# EAGLE design BeatleCPU2 (EAGLE 9.2.0)
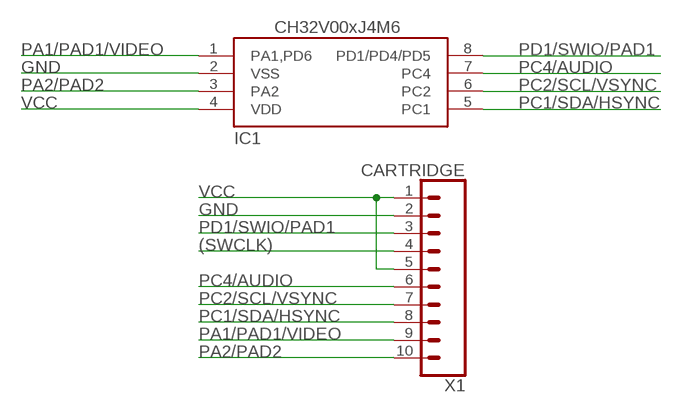
[diagram p0: schematic, sheet 1]

## Parts
IC1  CH32V00xJ4M6  CH32V003J4M6  [SOP8]
X1  CARTRIDGE  CONN_10  [1X10_LONGPADS]

## Nets
(SWCLK): X1.4
GND: IC1.2(VSS) X1.2
PA1/PAD1/VIDEO: IC1.1(PA1,PD6) X1.9
PA2/PAD2: IC1.3(PA2) X1.10
PC1/SDA/HSYNC: IC1.5(PC1) X1.8
PC2/SCL/VSYNC: IC1.6(PC2) X1.7
PC4/AUDIO: IC1.7(PC4) X1.6
PD1/SWIO/PAD1: IC1.8(PD1/PD4/PD5) X1.3
VCC: IC1.4(VDD) X1.1 X1.5

## Library data of the parts
IC1 = CH32V:CH32V003J4M6
X1 = SparkFun-Connectors:CONN_10: Multi connection point. Often used as Generic Header-pin footprint for 0.1 inch spaced/style header connections On any of the 0.1 inch spaced packages, you can populate with these: Break Away Headers - Straight <https://www.sparkfun.com/products/116> (PRT-00116) Break Away Male Headers - Right Angle <https://www.sparkfun.com/products/553> (PRT-00553) Female Headers <https://www.sparkfun.com/products/115> (PRT-00115) Break Away Headers - Machine Pin <https://www.sparkfun.com/products/117> (PRT-00117) Break Away Female Headers - Swiss Machine Pin <https://www.sparkfun.com/products/743> (PRT-00743) Arduino Stackable Header - 10 Pin <https://www.sparkfun.com/products/11376> (PRT-11376) For SCREWTERMINALS and SPRING TERMINALS visit here: Screw Terimnals on SparkFun.com <https://www.sparkfun.com/search/results?term=Screw+Terminals> (5mm/3.5mm/2.54mm spacing) This device is also useful as a general connection point to wire up your design to another part of your project. Our various solder wires solder well into these plated through hole pads. Hook-Up Wire - Assortment (Stranded, 22 AWG) <https://www.sparkfun.com/products/11375> (PRT-11375) Hook-Up Wire - Assortment (Solid Core, 22 AWG) <https://www.sparkfun.com/products/11367> (PRT-11367) View the entire wire category on our website here <https://www.sparkfun.com/categories/141> Special notes: Molex polarized connector foot print use with SKU : PRT-08231 with associated crimp pins and housings. 1MM SMD Version SKU: PRT-10208 NOTES ON THE VARIANTS LOCK and LOCK_LONGPADS... This footprint was designed to help hold the alignment of a through-hole component (i.e. 6-pin header) while soldering it into place. You may notice that each hole has been shifted either up or down by 0.005 of an inch from it's more standard position (which is a perfectly straight line). This slight alteration caused the pins (the squares in the middle) to touch the edges of the holes. Because they are alternating, it causes a "brace" to hold the component in place. 0.005 has proven to be the perfect amount of "off-center" position when using our standard breakaway headers. Although looks a little odd when you look at the bare footprint, once you have a header in there, the alteration is very hard to notice. Also,if you push a header all the way into place, it is covered up entirely on the bottom side.

## Board
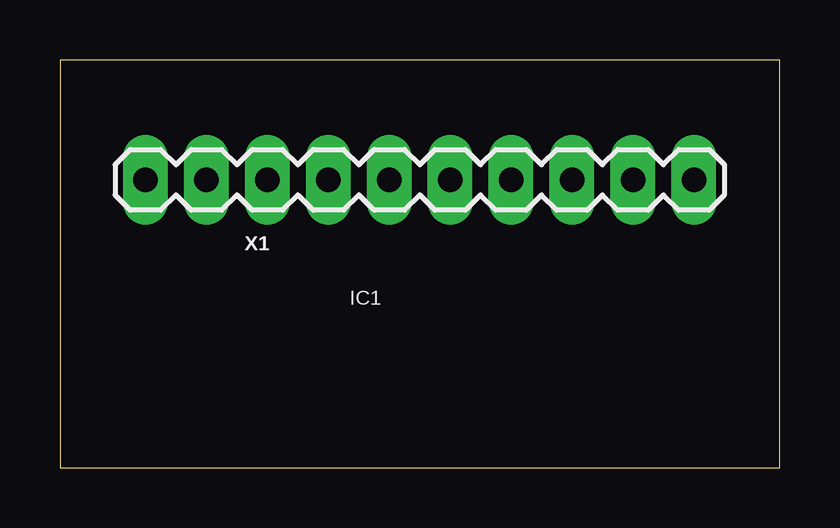
[diagram p1: board, top side]
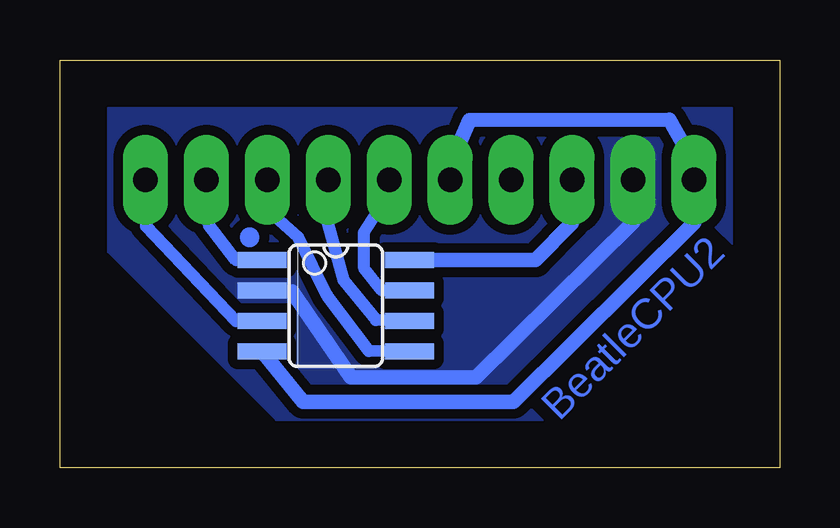
[diagram p2: board, bottom side, seen from below]

Size 30 x 17 mm. Coordinates in mm from the lower left corner, seen from the top.
Outline: 0,0 30,0 30,17 0,17 0,0
Copper layers (1*16): Top 0.035mm / dielectric 1.5mm / Bottom 0.035mm
Design rules "default": minimum track width 6mil, minimum drill 0.35mm, track to track 6mil, track to pad 6mil, pad to pad 6mil, via to via 6mil, smd to smd 6mil, copper to edge 40mil, drill to drill 6mil, minimum pad ring 10mil, minimum via ring 8mil, stop-mask expansion 4mil, vias tented up to drill 0mil, thermal gap 10mil

### Footprints (pad centres in the part's own frame; a part is rotated, then mirrored left to right if it is on the bottom)
SOP8 = smd 0.66 x 2.032: 1 -1.905,-3.073; 2 -0.635,-3.073; 3 0.635,-3.073; 4 1.905,-3.073; 5 1.905,3.073; 6 0.635,3.073; 7 -0.635,3.073; 8 -1.905,3.073
1X10_LONGPADS = drill 1.016 pad 1.88 long: 1 -11.43,0; 2 -8.89,0; 3 -6.35,0; 4 -3.81,0; 5 -1.27,0; 6 1.27,0; 7 3.81,0; 8 6.35,0; 9 8.89,0; 10 11.43,0

### Placement (x,y rotation side)
IC1  18.5,6.75 270 bottom
X1  15,12 0 top

### Tracks (layer width: path | path; a pad name or v marks a point on that pad's centre or on a via)
GND
  Bottom 0.61: IC1.2 20.33,7.35 17.87,3.76 12.65,3.77 6.1,10.24 X1.2
  pour Bottom (isolate 0.406, no thermals): 9,2 2,9 2,15 28,15 28,9 21,2
PA1/PAD1/VIDEO
  Bottom 0.508: IC1.1 22.65,8.64 23.82,10.16 X1.9
PA2/PAD2
  Bottom 0.508: IC1.3 22.66,6.1 26.41,10.07 X1.10
PC1/SDA/HSYNC
  Bottom 0.508: IC1.5 17.12,4.86 18.86,7.18 20.06,9.6 21.21,10.64 X1.8
PC2/SCL/VSYNC
  Bottom 0.508: IC1.6 16.83,6.16 18.16,7.79 18.82,10.19 X1.7
PC4/AUDIO
  Bottom 0.508: IC1.7 16.59,7.39 17.32,8.29 17.33,9.79 16.8,10.61 X1.6
PD1/SWIO/PAD1
  Bottom 0.61: IC1.8 10.17,8.65 8.66,10.19 X1.3
VCC
  Bottom 0.61: X1.5 13.73,12.66 12.94,14.48 4.58,14.5 3.62,12.79 X1.1 3.56,10.21 11.1,2.74 19.86,2.74 IC1.4
(copper drawn outside any net)
  shapes: Bottom circle x1

### Text on the board
Bottom: BeatleCPU2
tDocu: 1 | 10